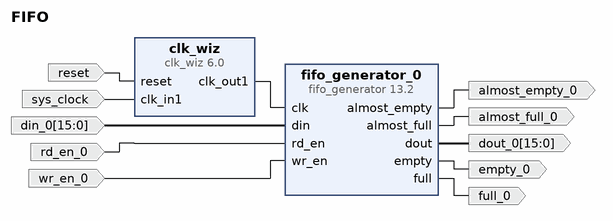
[diagram p0: block diagram of the top level]
# Vivado block design FIFO, xc7a35tcpg236-1, Vivado 2024.1
create_bd_design FIFO

create_bd_port -dir I -type clk sys_clock
set_property -dict {CONFIG.FREQ_HZ 100000000 CONFIG.PHASE 0.0} [get_bd_ports sys_clock]
create_bd_port -dir I -type rst reset
set_property -dict {CONFIG.POLARITY ACTIVE_HIGH} [get_bd_ports reset]
create_bd_port -dir O empty_0
create_bd_port -dir O almost_empty_0
create_bd_port -dir I wr_en_0
create_bd_port -dir I -from 15 -to 0 din_0
create_bd_port -dir O full_0
create_bd_port -dir O almost_full_0
create_bd_port -dir O -from 15 -to 0 dout_0
create_bd_port -dir I rd_en_0

create_bd_cell -type ip -vlnv xilinx.com:ip:fifo_generator:13.2 fifo_generator_0
set_property -dict [list \
  CONFIG.Almost_Empty_Flag true \
  CONFIG.Almost_Full_Flag true \
  CONFIG.Input_Data_Width 16 \
  CONFIG.Input_Depth 256 \
] [get_bd_cells fifo_generator_0]
create_bd_cell -type ip -vlnv xilinx.com:ip:clk_wiz:6.0 clk_wiz
set_property -dict [list \
  CONFIG.CLKOUT1_REQUESTED_OUT_FREQ 100 \
  CONFIG.CLK_IN1_BOARD_INTERFACE sys_clock \
  CONFIG.RESET_BOARD_INTERFACE reset \
  CONFIG.USE_BOARD_FLOW true \
] [get_bd_cells clk_wiz]

# ---- connections ----

connect_bd_net [get_bd_pins clk_wiz/clk_out1] [get_bd_pins fifo_generator_0/clk]
connect_bd_net -net din_0_1 [get_bd_ports din_0] [get_bd_pins fifo_generator_0/din]
connect_bd_net [get_bd_pins fifo_generator_0/almost_empty] [get_bd_ports almost_empty_0]
connect_bd_net [get_bd_pins fifo_generator_0/almost_full] [get_bd_ports almost_full_0]
connect_bd_net [get_bd_pins fifo_generator_0/dout] [get_bd_ports dout_0]
connect_bd_net [get_bd_pins fifo_generator_0/empty] [get_bd_ports empty_0]
connect_bd_net [get_bd_pins fifo_generator_0/full] [get_bd_ports full_0]
connect_bd_net -net rd_en_0_1 [get_bd_ports rd_en_0] [get_bd_pins fifo_generator_0/rd_en]
connect_bd_net [get_bd_ports reset] [get_bd_pins clk_wiz/reset]
connect_bd_net [get_bd_ports sys_clock] [get_bd_pins clk_wiz/clk_in1]
connect_bd_net -net wr_en_0_1 [get_bd_ports wr_en_0] [get_bd_pins fifo_generator_0/wr_en]

validate_bd_design
save_bd_design
